# Altium schematic sheet Mother Board FPGA.SchDoc
size A2
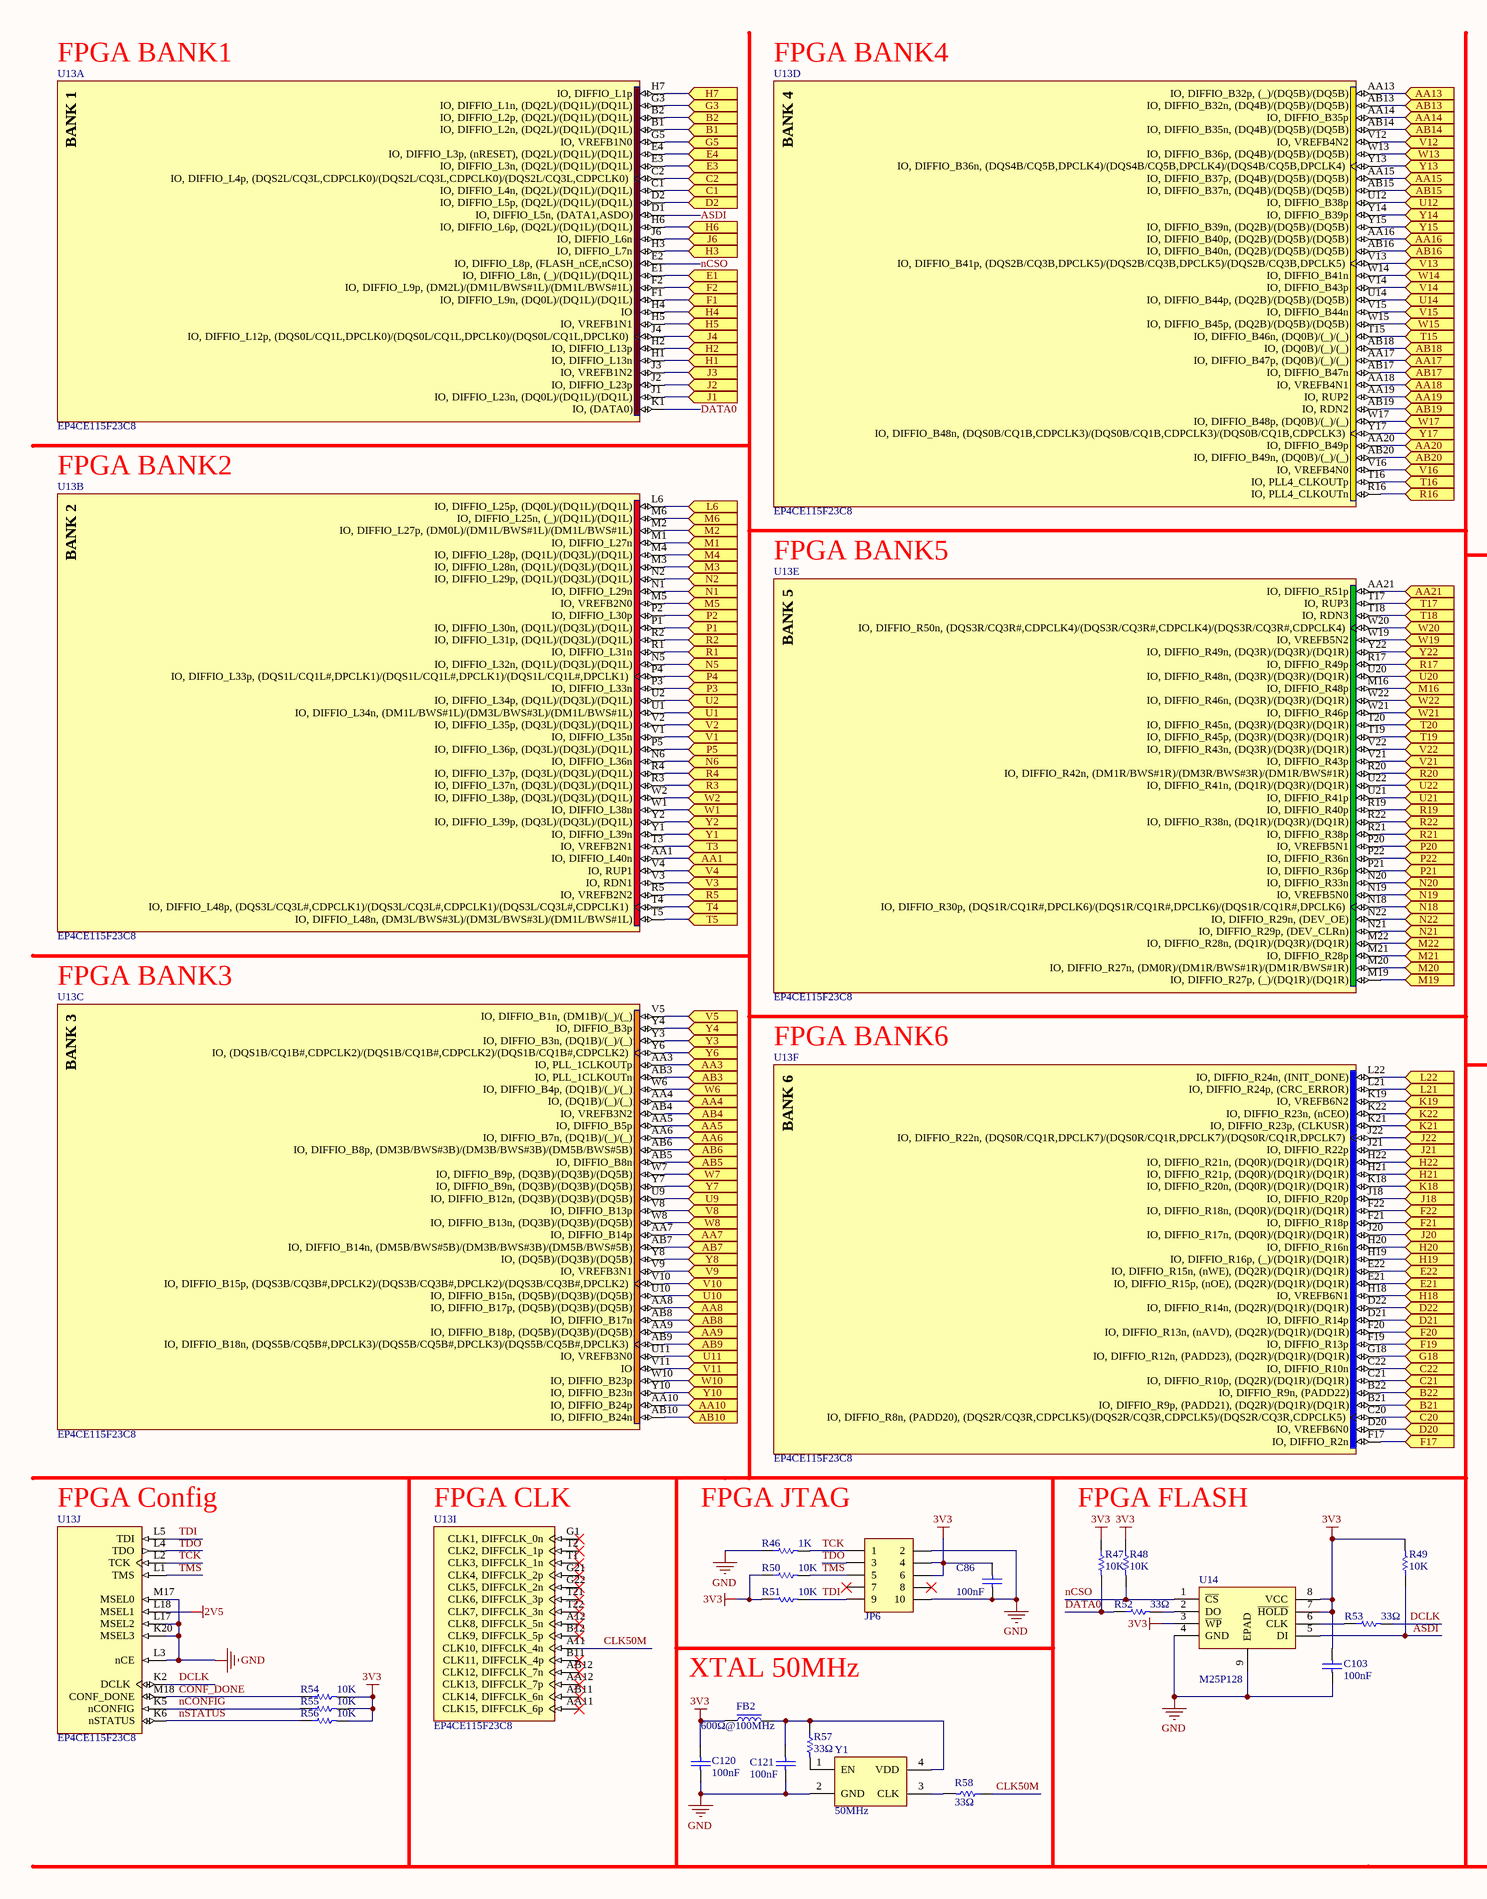
[diagram p0: Mother Board FPGA.SchDoc, left]
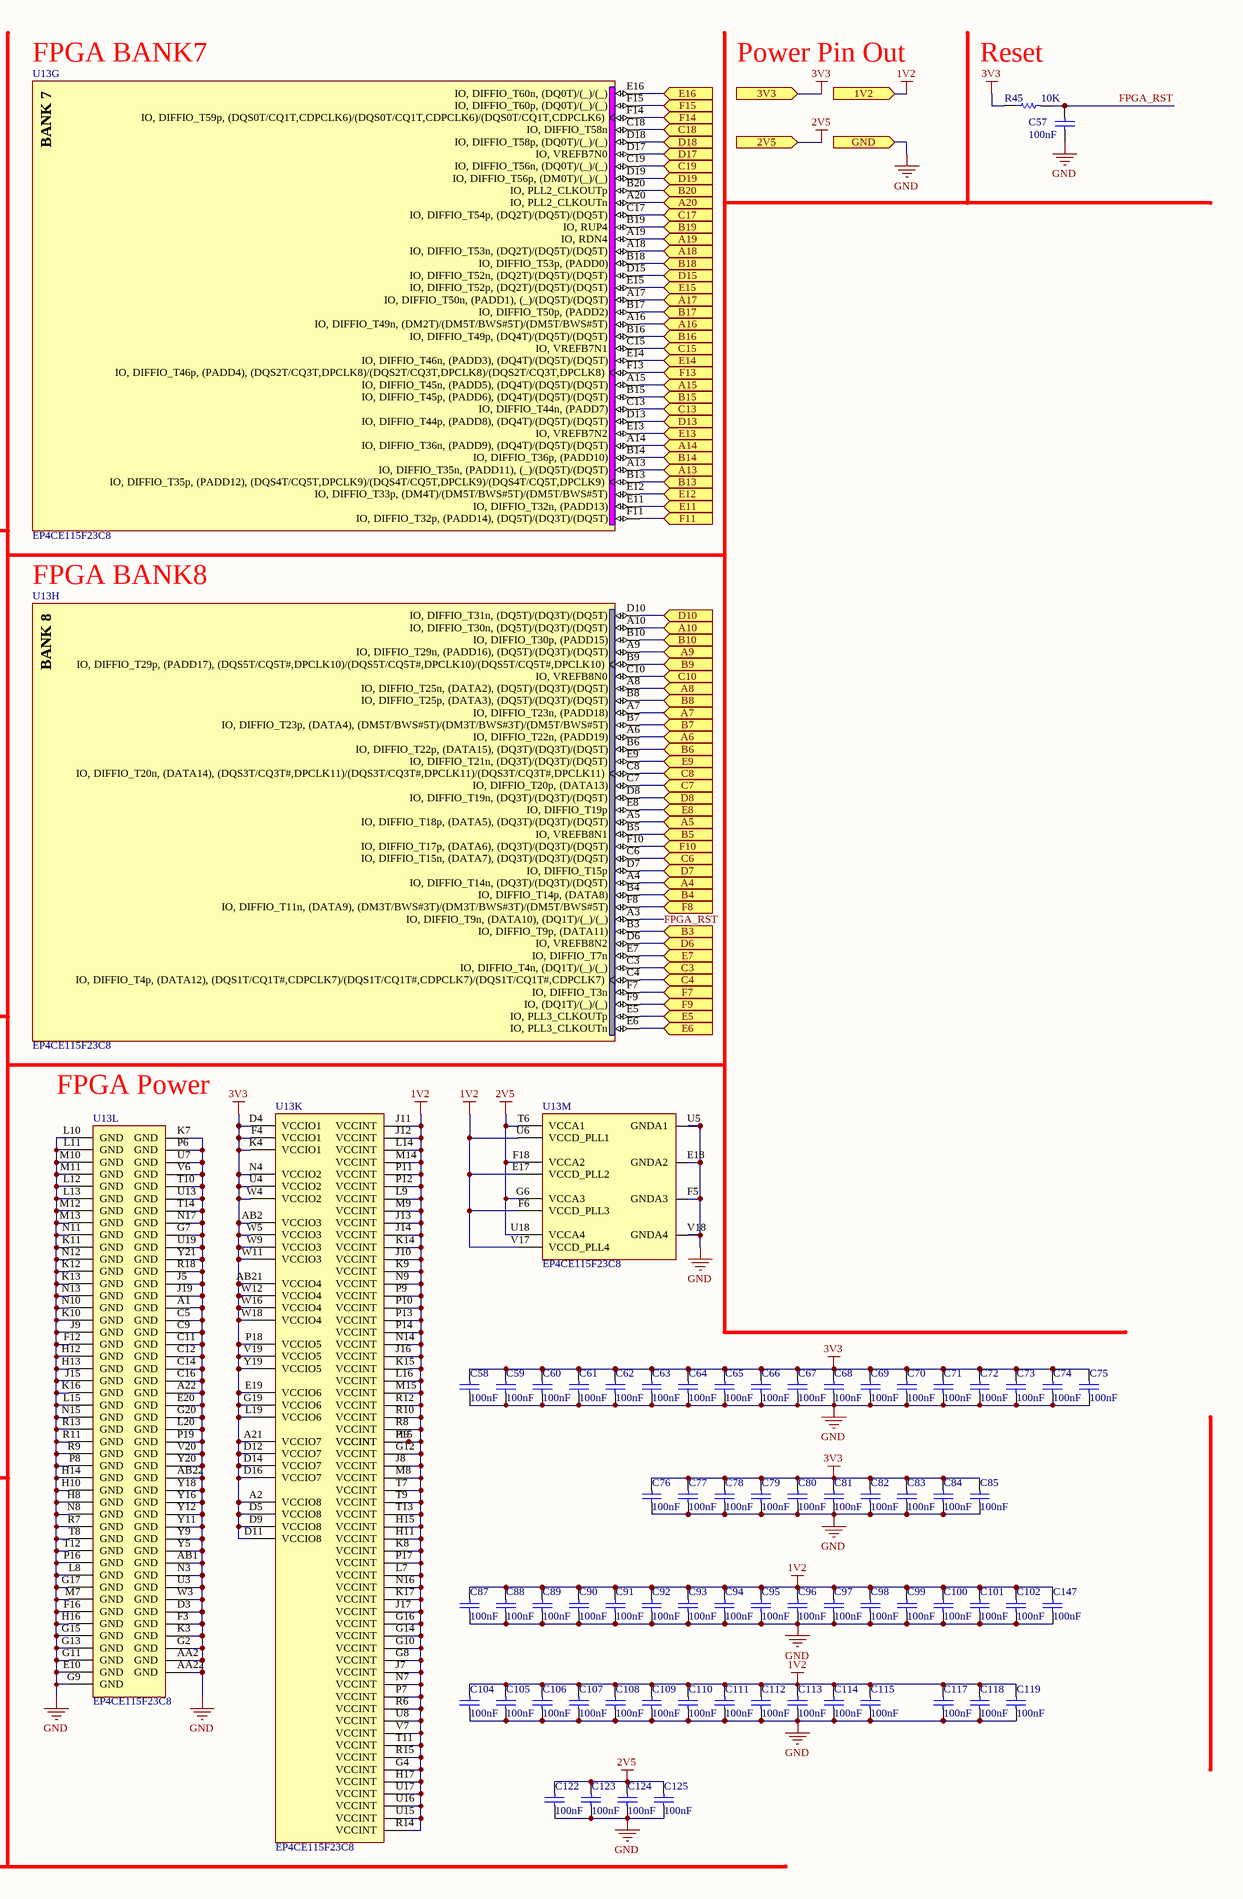
[diagram p1: Mother Board FPGA.SchDoc, right]

## Parts
C57  100nF  [C0402]
C58  100nF  [C0402]
C59  100nF  [C0402]
C60  100nF  [C0402]
C61  100nF  [C0402]
C62  100nF  [C0402]
C63  100nF  [C0402]
C64  100nF  [C0402]
C65  100nF  [C0402]
C66  100nF  [C0402]
C67  100nF  [C0402]
C68  100nF  [C0402]
C69  100nF  [C0402]
C70  100nF  [C0402]
C71  100nF  [C0402]
C72  100nF  [C0402]
C73  100nF  [C0402]
C74  100nF  [C0402]
C75  100nF  [C0402]
C76  100nF  [C0402]
C77  100nF  [C0402]
C78  100nF  [C0402]
C79  100nF  [C0402]
C80  100nF  [C0402]
C81  100nF  [C0402]
C82  100nF  [C0402]
C83  100nF  [C0402]
C84  100nF  [C0402]
C85  100nF  [C0402]
C86  100nF  [C0603]
C87  100nF  [C0402]
C88  100nF  [C0402]
C89  100nF  [C0402]
C90  100nF  [C0402]
C91  100nF  [C0402]
C92  100nF  [C0402]
C93  100nF  [C0402]
C94  100nF  [C0402]
C95  100nF  [C0402]
C96  100nF  [C0402]
C97  100nF  [C0402]
C98  100nF  [C0402]
C99  100nF  [C0402]
C100  100nF  [C0402]
C101  100nF  [C0402]
C102  100nF  [C0402]
C103  100nF  [C0603]
C104  100nF  [C0402]
C105  100nF  [C0402]
C106  100nF  [C0402]
C107  100nF  [C0402]
C108  100nF  [C0402]
C109  100nF  [C0402]
C110  100nF  [C0402]
C111  100nF  [C0402]
C112  100nF  [C0402]
C113  100nF  [C0402]
C114  100nF  [C0402]
C115  100nF  [C0402]
C117  100nF  [C0402]
C118  100nF  [C0402]
C119  100nF  [C0402]
C120  100nF  [C0603]
C121  100nF  [C0603]
C122  100nF  [C0402]
C123  100nF  [C0402]
C124  100nF  [C0402]
C125  100nF  [C0402]
C147  100nF  [C0402]
FB2  600Ω@100MHz  [FB 0603]
JP6  Header 5X2  [DC2.54-10P - L2]  (value not drawn)
R45  10K  [R0402]
R46  1K  [R0603]
R47  10K  [R0603]
R48  10K  [R0603]
R49  10K  [R0603]
R50  10K  [R0603]
R51  10K  [R0603]
R52  33Ω  [R0603]
R53  33Ω  [R0603]
R54  10K  [R0402]
R55  10K  [R0402]
R56  10K  [R0402]
R57  33Ω  [R0603]
R58  33Ω  [R0603]
U13  EP4CE115F23C8  [FBGA484]  (parts A,B,C,D,E,F,G,H,I,J,K,L,M of 13)
U14  M25P128  [WSON8_8X6_MRN]
Y1  50MHz  [XTAL-3225]

## Ports
1V2 (in), 2V5 (in), 3V3 (in), A4 (in), A5 (in), A6 (in), A7 (in), A8 (in), A9 (in), A10 (in), A13 (in), A14 (in), A15 (in), A16 (in), A17 (in), A18 (in), A19 (in), A20 (in), AA1 (in), AA3 (in), AA4 (in), AA5 (in), AA6 (in), AA7 (in), AA8 (in), AA9 (in), AA10 (in), AA13 (in), AA14 (in), AA15 (in), AA16 (in), AA17 (in), AA18 (in), AA19 (in), AA20 (in), AA21 (in), AB3 (in), AB4 (in), AB5 (in), AB6 (in), AB7 (in), AB8 (in), AB9 (in), AB10 (in), AB13 (in), AB14 (in), AB15 (in), AB16 (in), AB17 (in), AB18 (in), AB19 (in), AB20 (in), B1 (in), B2 (in), B3 (in), B4 (in), B5 (in), B6 (in), B7 (in), B8 (in), B9 (in), B10 (in), B13 (in), B14 (in), B15 (in), B16 (in), B17 (in), B18 (in), B19 (in), B20 (in), B21 (in), B22 (in), C1 (in), C2 (in), C3 (in), C4 (in), C6 (in), C7 (in), C8 (in), C10 (in), C13 (in), C15 (in), C17 (in), C18 (in), C19 (in), C20 (in), C21 (in), C22 (in), D2 (in), D6 (in), D7 (in), D8 (in), D10 (in), D13 (in), D15 (in), D17 (in), D18 (in), D19 (in), D20 (in), D21 (in), D22 (in), E1 (in), E3 (in), E4 (in), E5 (in), E6 (in), E7 (in), E8 (in), E9 (in), E11 (in), E12 (in), E13 (in), E14 (in), E15 (in), E16 (in), E21 (in), E22 (in), F1 (in), F2 (in), F7 (in), F8 (in), F9 (in), F10 (in), F11 (in), F13 (in), F14 (in), F15 (in), F17 (in), F19 (in), F20 (in), F21 (in), F22 (in), G3 (in), G5 (in), G18 (in), GND (in), H1 (in), H2 (in), H3 (in), H4 (in), H5 (in), H6 (in), H7 (in), H18 (in), H19 (in), H20 (in), H21 (in), H22 (in), J1 (in), J2 (in), J3 (in), J4 (in), J6 (in), J18 (in), J20 (in), J21 (in), J22 (in), K18 (in), K19 (in), K21 (in), K22 (in), L6 (in), L21 (in), L22 (in), M1 (in), M2 (in), M3 (in), M4 (in), M5 (in), M6 (in), M16 (in), M19 (in), M20 (in), M21 (in), M22 (in), N1 (in), N2 (in), N5 (in), N6 (in), N18 (in), N19 (in), N20 (in), N21 (in), N22 (in), P1 (in), P2 (in), P3 (in), P4 (in), P5 (in), P20 (in), P21 (in), P22 (in), R1 (in), R2 (in), R3 (in), R4 (in), R5 (in), R16 (in), R17 (in), R19 (in), R20 (in), R21 (in), R22 (in), T3 (in), T4 (in), T5 (in), T15 (in), T16 (in), T17 (in), T18 (in), T19 (in), T20 (in), U1 (in), U2 (in), U9 (in), U10 (in), U11 (in), U12 (in), U14 (in), U20 (in), U21 (in), U22 (in), V1 (in), V2 (in), V3 (in), V4 (in), V5 (in), V8 (in), V9 (in), V10 (in), V11 (in), V12 (in), V13 (in), V14 (in), V15 (in), V16 (in), V21 (in), V22 (in), W1 (in), W2 (in), W6 (in), W7 (in), W8 (in), W10 (in), W13 (in), W14 (in), W15 (in), W17 (in), W19 (in), W20 (in), W21 (in), W22 (in), Y1 (in), Y2 (in), Y3 (in), Y4 (in), Y6 (in), Y7 (in), Y8 (in), Y10 (in), Y13 (in), Y14 (in), Y15 (in), Y17 (in), Y22 (in)

## Nets
1V2: C87.2 C88.2 C89.2 C90.2 C91.2 C92.2 C93.2 C94.2 C95.2 C96.2 C97.2 C98.2 C99.2 C100.2 C101.2 C102.2 C104.2 C105.2 C106.2 C107.2 C108.2 C109.2 C110.2 C111.2 C112.2 C113.2 C114.2 C115.2 C117.2 C118.2 C119.2 C147.2 U13.E17(VCCD_PLL2) U13.F6(VCCD_PLL3) U13.G4(VCCINT) U13.G8(VCCINT) U13.G10(VCCINT) U13.G12(VCCINT) U13.G14(VCCINT) U13.G16(VCCINT) U13.H9(VCCINT) U13.H11(VCCINT) U13.H15(VCCINT) U13.H17(VCCINT) U13.J7(VCCINT) U13.J8(VCCINT) U13.J10(VCCINT) U13.J11(VCCINT) U13.J12(VCCINT) U13.J13(VCCINT) U13.J14(VCCINT) U13.J16(VCCINT) U13.J17(VCCINT) U13.K8(VCCINT) U13.K9(VCCINT) U13.K14(VCCINT) U13.K15(VCCINT) U13.K17(VCCINT) U13.L7(VCCINT) U13.L9(VCCINT) U13.L14(VCCINT) U13.L16(VCCINT) U13.M8(VCCINT) U13.M9(VCCINT) U13.M14(VCCINT) U13.M15(VCCINT) U13.N7(VCCINT) U13.N9(VCCINT) U13.N14(VCCINT) U13.N16(VCCINT) U13.P7(VCCINT) U13.P9(VCCINT) U13.P10(VCCINT) U13.P11(VCCINT) U13.P12(VCCINT) U13.P13(VCCINT) U13.P14(VCCINT) U13.P15(VCCINT) U13.P17(VCCINT) U13.R6(VCCINT) U13.R8(VCCINT) U13.R10(VCCINT) U13.R12(VCCINT) U13.R14(VCCINT) U13.R15(VCCINT) U13.T7(VCCINT) U13.T9(VCCINT) U13.T11(VCCINT) U13.T13(VCCINT) U13.U6(VCCD_PLL1) U13.U8(VCCINT) U13.U15(VCCINT) U13.U16(VCCINT) U13.U17(VCCINT) U13.V7(VCCINT) U13.V17(VCCD_PLL4) ; port 1V2
2V5: C122.2 C123.2 C124.2 C125.2 U13.F18(VCCA2) U13.G6(VCCA3) U13.L18(MSEL1) U13.T6(VCCA1) U13.U18(VCCA4) ; port 2V5
3V3: C58.2 C59.2 C60.2 C61.2 C62.2 C63.2 C64.2 C65.2 C66.2 C67.2 C68.2 C69.2 C70.2 C71.2 C72.2 C73.2 C74.2 C75.2 C76.2 C77.2 C78.2 C79.2 C80.2 C81.2 C82.2 C83.2 C84.2 C85.2 C86.2 C103.1 C120.1 FB2.1 JP6.4 JP6.6 R45.1 R47.1 R48.1 R49.2 R50.1 R51.1 R54.2 R55.2 R56.2 U13.A2(VCCIO8) U13.A21(VCCIO7) U13.AB2(VCCIO3) U13.AB21(VCCIO4) U13.D4(VCCIO1) U13.D5(VCCIO8) U13.D9(VCCIO8) U13.D11(VCCIO8) U13.D12(VCCIO7) U13.D14(VCCIO7) U13.D16(VCCIO7) U13.E19(VCCIO6) U13.F4(VCCIO1) U13.G19(VCCIO6) U13.K4(VCCIO1) U13.L19(VCCIO6) U13.N4(VCCIO2) U13.P18(VCCIO5) U13.U4(VCCIO2) U13.V19(VCCIO5) U13.W4(VCCIO2) U13.W5(VCCIO3) U13.W9(VCCIO3) U13.W11(VCCIO3) U13.W12(VCCIO4) U13.W16(VCCIO4) U13.W18(VCCIO4) U13.Y19(VCCIO5) U14.3(~{WP}) U14.7(~{HOLD}) U14.8(VCC) ; port 3V3
GND: C57.1 C58.1 C59.1 C60.1 C61.1 C62.1 C63.1 C64.1 C65.1 C66.1 C67.1 C68.1 C69.1 C70.1 C71.1 C72.1 C73.1 C74.1 C75.1 C76.1 C77.1 C78.1 C79.1 C80.1 C81.1 C82.1 C83.1 C84.1 C85.1 C86.1 C87.1 C88.1 C89.1 C90.1 C91.1 C92.1 C93.1 C94.1 C95.1 C96.1 C97.1 C98.1 C99.1 C100.1 C101.1 C102.1 C103.2 C104.1 C105.1 C106.1 C107.1 C108.1 C109.1 C110.1 C111.1 C112.1 C113.1 C114.1 C115.1 C117.1 C118.1 C119.1 C120.2 C121.1 C122.1 C123.1 C124.1 C125.1 C147.1 JP6.2 JP6.10 R46.1 U13.A1(GND) U13.A22(GND) U13.AA2(GND) U13.AA22(GND) U13.AB1(GND) U13.AB22(GND) U13.C5(GND) U13.C9(GND) U13.C11(GND) U13.C12(GND) U13.C14(GND) U13.C16(GND) U13.D3(GND) U13.E10(GND) U13.E18(GNDA2) U13.E20(GND) U13.F3(GND) U13.F5(GNDA3) U13.F12(GND) U13.F16(GND) U13.G2(GND) U13.G7(GND) U13.G9(GND) U13.G11(GND) U13.G13(GND) U13.G15(GND) U13.G17(GND) U13.G20(GND) U13.H8(GND) U13.H10(GND) U13.H12(GND) U13.H13(GND) U13.H14(GND) U13.H16(GND) U13.J5(GND) U13.J9(GND) U13.J15(GND) U13.J19(GND) U13.K3(GND) U13.K7(GND) U13.K10(GND) U13.K11(GND) U13.K12(GND) U13.K13(GND) U13.K16(GND) U13.K20(MSEL3) U13.L3(nCE) U13.L8(GND) U13.L10(GND) U13.L11(GND) U13.L12(GND) U13.L13(GND) U13.L15(GND) U13.L17(MSEL2) U13.L20(GND) U13.M7(GND) U13.M10(GND) U13.M11(GND) U13.M12(GND) U13.M13(GND) U13.M17(MSEL0) U13.N3(GND) U13.N8(GND) U13.N10(GND) U13.N11(GND) U13.N12(GND) U13.N13(GND) U13.N15(GND) U13.N17(GND) U13.P6(GND) U13.P8(GND) U13.P16(GND) U13.P19(GND) U13.R7(GND) U13.R9(GND) U13.R11(GND) U13.R13(GND) U13.R18(GND) U13.T8(GND) U13.T10(GND) U13.T12(GND) U13.T14(GND) U13.U3(GND) U13.U5(GNDA1) U13.U7(GND) U13.U13(GND) U13.U19(GND) U13.V6(GND) U13.V18(GNDA4) U13.V20(GND) U13.W3(GND) U13.Y5(GND) U13.Y9(GND) U13.Y11(GND) U13.Y12(GND) U13.Y16(GND) U13.Y18(GND) U13.Y20(GND) U13.Y21(GND) U14.4(GND) U14.9(EPAD) Y1.2(GND) ; port GND
A4: U13.A4(IO,_DIFFIO_T14n,_(DQ3T)/(DQ3T)/(DQ5T)) ; port A4
A5: U13.A5(IO,_DIFFIO_T18p,_(DATA5),_(DQ3T)/(DQ3T)/(DQ5T)) ; port A5
A6: U13.A6(IO,_DIFFIO_T22n,_(PADD19)) ; port A6
A7: U13.A7(IO,_DIFFIO_T23n,_(PADD18)) ; port A7
A8: U13.A8(IO,_DIFFIO_T25n,_(DATA2),_(DQ5T)/(DQ3T)/(DQ5T)) ; port A8
A9: U13.A9(IO,_DIFFIO_T29n,_(PADD16),_(DQ5T)/(DQ3T)/(DQ5T)) ; port A9
A10: U13.A10(IO,_DIFFIO_T30n,_(DQ5T)/(DQ3T)/(DQ5T)) ; port A10
A13: U13.A13(IO,_DIFFIO_T35n,_(PADD11),_(_)/(DQ5T)/(DQ5T)) ; port A13
A14: U13.A14(IO,_DIFFIO_T36n,_(PADD9),_(DQ4T)/(DQ5T)/(DQ5T)) ; port A14
A15: U13.A15(IO,_DIFFIO_T45n,_(PADD5),_(DQ4T)/(DQ5T)/(DQ5T)) ; port A15
A16: U13.A16(IO,_DIFFIO_T49n,_(DM2T)/(DM5T/BWS#5T)/(DM5T/BWS#5T)) ; port A16
A17: U13.A17(IO,_DIFFIO_T50n,_(PADD1),_(_)/(DQ5T)/(DQ5T)) ; port A17
A18: U13.A18(IO,_DIFFIO_T53n,_(DQ2T)/(DQ5T)/(DQ5T)) ; port A18
A19: U13.A19(IO,_RDN4) ; port A19
A20: U13.A20(IO,_PLL2_CLKOUTn) ; port A20
AA1: U13.AA1(IO,_DIFFIO_L40n) ; port AA1
AA3: U13.AA3(IO,_PLL_1CLKOUTp) ; port AA3
AA4: U13.AA4(IO,_(DQ1B)/(_)/(_)) ; port AA4
AA5: U13.AA5(IO,_DIFFIO_B5p) ; port AA5
AA6: U13.AA6(IO,_DIFFIO_B7n,_(DQ1B)/(_)/(_)) ; port AA6
AA7: U13.AA7(IO,_DIFFIO_B14p) ; port AA7
AA8: U13.AA8(IO,_DIFFIO_B17p,_(DQ5B)/(DQ3B)/(DQ5B)) ; port AA8
AA9: U13.AA9(IO,_DIFFIO_B18p,_(DQ5B)/(DQ3B)/(DQ5B)) ; port AA9
AA10: U13.AA10(IO,_DIFFIO_B24p) ; port AA10
AA13: U13.AA13(IO,_DIFFIO_B32p,_(_)/(DQ5B)/(DQ5B)) ; port AA13
AA14: U13.AA14(IO,_DIFFIO_B35p) ; port AA14
AA15: U13.AA15(IO,_DIFFIO_B37p,_(DQ4B)/(DQ5B)/(DQ5B)) ; port AA15
AA16: U13.AA16(IO,_DIFFIO_B40p,_(DQ2B)/(DQ5B)/(DQ5B)) ; port AA16
AA17: U13.AA17(IO,_DIFFIO_B47p,_(DQ0B)/(_)/(_)) ; port AA17
AA18: U13.AA18(IO,_VREFB4N1) ; port AA18
AA19: U13.AA19(IO,_RUP2) ; port AA19
AA20: U13.AA20(IO,_DIFFIO_B49p) ; port AA20
AA21: U13.AA21(IO,_DIFFIO_R51p) ; port AA21
AB3: U13.AB3(IO,_PLL_1CLKOUTn) ; port AB3
AB4: U13.AB4(IO,_VREFB3N2) ; port AB4
AB5: U13.AB5(IO,_DIFFIO_B8n) ; port AB5
AB6: U13.AB6(IO,_DIFFIO_B8p,_(DM3B/BWS#3B)/(DM3B/BWS#3B)/(DM5B/BWS#5B)) ; port AB6
AB7: U13.AB7(IO,_DIFFIO_B14n,_(DM5B/BWS#5B)/(DM3B/BWS#3B)/(DM5B/BWS#5B)) ; port AB7
AB8: U13.AB8(IO,_DIFFIO_B17n) ; port AB8
AB9: U13.AB9(IO,_DIFFIO_B18n,_(DQS5B/CQ5B#,DPCLK3)/(DQS5B/CQ5B#,DPCLK3)/(DQS5B/CQ5B#,DPCLK3)) ; port AB9
AB10: U13.AB10(IO,_DIFFIO_B24n) ; port AB10
AB13: U13.AB13(IO,_DIFFIO_B32n,_(DQ4B)/(DQ5B)/(DQ5B)) ; port AB13
AB14: U13.AB14(IO,_DIFFIO_B35n,_(DQ4B)/(DQ5B)/(DQ5B)) ; port AB14
AB15: U13.AB15(IO,_DIFFIO_B37n,_(DQ4B)/(DQ5B)/(DQ5B)) ; port AB15
AB16: U13.AB16(IO,_DIFFIO_B40n,_(DQ2B)/(DQ5B)/(DQ5B)) ; port AB16
AB17: U13.AB17(IO,_DIFFIO_B47n) ; port AB17
AB18: U13.AB18(IO,_(DQ0B)/(_)/(_)) ; port AB18
AB19: U13.AB19(IO,_RDN2) ; port AB19
AB20: U13.AB20(IO,_DIFFIO_B49n,_(DQ0B)/(_)/(_)) ; port AB20
ASDI: R49.1 U13.D1(IO,_DIFFIO_L5n,_(DATA1,ASDO)) U14.5(DI)
B1: U13.B1(IO,_DIFFIO_L2n,_(DQ2L)/(DQ1L)/(DQ1L)) ; port B1
B2: U13.B2(IO,_DIFFIO_L2p,_(DQ2L)/(DQ1L)/(DQ1L)) ; port B2
B3: U13.B3(IO,_DIFFIO_T9p,_(DATA11)) ; port B3
B4: U13.B4(IO,_DIFFIO_T14p,_(DATA8)) ; port B4
B5: U13.B5(IO,_VREFB8N1) ; port B5
B6: U13.B6(IO,_DIFFIO_T22p,_(DATA15),_(DQ3T)/(DQ3T)/(DQ5T)) ; port B6
B7: U13.B7(IO,_DIFFIO_T23p,_(DATA4),_(DM5T/BWS#5T)/(DM3T/BWS#3T)/(DM5T/BWS#5T)) ; port B7
B8: U13.B8(IO,_DIFFIO_T25p,_(DATA3),_(DQ5T)/(DQ3T)/(DQ5T)) ; port B8
B9: U13.B9(IO,_DIFFIO_T29p,_(PADD17),_(DQS5T/CQ5T#,DPCLK10)/(DQS5T/CQ5T#,DPCLK10)/(DQS5T/CQ5T#,DPCLK10)) ; port B9
B10: U13.B10(IO,_DIFFIO_T30p,_(PADD15)) ; port B10
B13: U13.B13(IO,_DIFFIO_T35p,_(PADD12),_(DQS4T/CQ5T,DPCLK9)/(DQS4T/CQ5T,DPCLK9)/(DQS4T/CQ5T,DPCLK9)) ; port B13
B14: U13.B14(IO,_DIFFIO_T36p,_(PADD10)) ; port B14
B15: U13.B15(IO,_DIFFIO_T45p,_(PADD6),_(DQ4T)/(DQ5T)/(DQ5T)) ; port B15
B16: U13.B16(IO,_DIFFIO_T49p,_(DQ4T)/(DQ5T)/(DQ5T)) ; port B16
B17: U13.B17(IO,_DIFFIO_T50p,_(PADD2)) ; port B17
B18: U13.B18(IO,_DIFFIO_T53p,_(PADD0)) ; port B18
B19: U13.B19(IO,_RUP4) ; port B19
B20: U13.B20(IO,_PLL2_CLKOUTp) ; port B20
B21: U13.B21(IO,_DIFFIO_R9p,_(PADD21),_(DQ2R)/(DQ1R)/(DQ1R)) ; port B21
B22: U13.B22(IO,_DIFFIO_R9n,_(PADD22)) ; port B22
C1: U13.C1(IO,_DIFFIO_L4n,_(DQ2L)/(DQ1L)/(DQ1L)) ; port C1
C2: U13.C2(IO,_DIFFIO_L4p,_(DQS2L/CQ3L,CDPCLK0)/(DQS2L/CQ3L,CDPCLK0)/(DQS2L/CQ3L,CDPCLK0)) ; port C2
C3: U13.C3(IO,_DIFFIO_T4n,_(DQ1T)/(_)/(_)) ; port C3
C4: U13.C4(IO,_DIFFIO_T4p,_(DATA12),_(DQS1T/CQ1T#,CDPCLK7)/(DQS1T/CQ1T#,CDPCLK7)/(DQS1T/CQ1T#,CDPCLK7)) ; port C4
C6: U13.C6(IO,_DIFFIO_T15n,_(DATA7),_(DQ3T)/(DQ3T)/(DQ5T)) ; port C6
C7: U13.C7(IO,_DIFFIO_T20p,_(DATA13)) ; port C7
C8: U13.C8(IO,_DIFFIO_T20n,_(DATA14),_(DQS3T/CQ3T#,DPCLK11)/(DQS3T/CQ3T#,DPCLK11)/(DQS3T/CQ3T#,DPCLK11)) ; port C8
C10: U13.C10(IO,_VREFB8N0) ; port C10
C13: U13.C13(IO,_DIFFIO_T44n,_(PADD7)) ; port C13
C15: U13.C15(IO,_VREFB7N1) ; port C15
C17: U13.C17(IO,_DIFFIO_T54p,_(DQ2T)/(DQ5T)/(DQ5T)) ; port C17
C18: U13.C18(IO,_DIFFIO_T58n) ; port C18
C19: U13.C19(IO,_DIFFIO_T56n,_(DQ0T)/(_)/(_)) ; port C19
C20: U13.C20(IO,_DIFFIO_R8n,_(PADD20),_(DQS2R/CQ3R,CDPCLK5)/(DQS2R/CQ3R,CDPCLK5)/(DQS2R/CQ3R,CDPCLK5)) ; port C20
C21: U13.C21(IO,_DIFFIO_R10p,_(DQ2R)/(DQ1R)/(DQ1R)) ; port C21
C22: U13.C22(IO,_DIFFIO_R10n) ; port C22
CLK50M: R58.1 U13.A11(CLK10,_DIFFCLK_4n)
CONF_DONE: R54.1 U13.M18(CONF_DONE)
D2: U13.D2(IO,_DIFFIO_L5p,_(DQ2L)/(DQ1L)/(DQ1L)) ; port D2
D6: U13.D6(IO,_VREFB8N2) ; port D6
D7: U13.D7(IO,_DIFFIO_T15p) ; port D7
D8: U13.D8(IO,_DIFFIO_T19n,_(DQ3T)/(DQ3T)/(DQ5T)) ; port D8
D10: U13.D10(IO,_DIFFIO_T31n,_(DQ5T)/(DQ3T)/(DQ5T)) ; port D10
D13: U13.D13(IO,_DIFFIO_T44p,_(PADD8),_(DQ4T)/(DQ5T)/(DQ5T)) ; port D13
D15: U13.D15(IO,_DIFFIO_T52n,_(DQ2T)/(DQ5T)/(DQ5T)) ; port D15
D17: U13.D17(IO,_VREFB7N0) ; port D17
D18: U13.D18(IO,_DIFFIO_T58p,_(DQ0T)/(_)/(_)) ; port D18
D19: U13.D19(IO,_DIFFIO_T56p,_(DM0T)/(_)/(_)) ; port D19
D20: U13.D20(IO,_VREFB6N0) ; port D20
D21: U13.D21(IO,_DIFFIO_R14p) ; port D21
D22: U13.D22(IO,_DIFFIO_R14n,_(DQ2R)/(DQ1R)/(DQ1R)) ; port D22
DATA0: R47.2 R52.1 U13.K1(IO,_(DATA0))
DCLK: R53.2 U13.K2(DCLK)
E1: U13.E1(IO,_DIFFIO_L8n,_(_)/(DQ1L)/(DQ1L)) ; port E1
E3: U13.E3(IO,_DIFFIO_L3n,_(DQ2L)/(DQ1L)/(DQ1L)) ; port E3
E4: U13.E4(IO,_DIFFIO_L3p,_(nRESET),_(DQ2L)/(DQ1L)/(DQ1L)) ; port E4
E5: U13.E5(IO,_PLL3_CLKOUTp) ; port E5
E6: U13.E6(IO,_PLL3_CLKOUTn) ; port E6
E7: U13.E7(IO,_DIFFIO_T7n) ; port E7
E8: U13.E8(IO,_DIFFIO_T19p) ; port E8
E9: U13.E9(IO,_DIFFIO_T21n,_(DQ3T)/(DQ3T)/(DQ5T)) ; port E9
E11: U13.E11(IO,_DIFFIO_T32n,_(PADD13)) ; port E11
E12: U13.E12(IO,_DIFFIO_T33p,_(DM4T)/(DM5T/BWS#5T)/(DM5T/BWS#5T)) ; port E12
E13: U13.E13(IO,_VREFB7N2) ; port E13
E14: U13.E14(IO,_DIFFIO_T46n,_(PADD3),_(DQ4T)/(DQ5T)/(DQ5T)) ; port E14
E15: U13.E15(IO,_DIFFIO_T52p,_(DQ2T)/(DQ5T)/(DQ5T)) ; port E15
E16: U13.E16(IO,_DIFFIO_T60n,_(DQ0T)/(_)/(_)) ; port E16
E21: U13.E21(IO,_DIFFIO_R15p,_(nOE),_(DQ2R)/(DQ1R)/(DQ1R)) ; port E21
E22: U13.E22(IO,_DIFFIO_R15n,_(nWE),_(DQ2R)/(DQ1R)/(DQ1R)) ; port E22
F1: U13.F1(IO,_DIFFIO_L9n,_(DQ0L)/(DQ1L)/(DQ1L)) ; port F1
F2: U13.F2(IO,_DIFFIO_L9p,_(DM2L)/(DM1L/BWS#1L)/(DM1L/BWS#1L)) ; port F2
F7: U13.F7(IO,_DIFFIO_T3n) ; port F7
F8: U13.F8(IO,_DIFFIO_T11n,_(DATA9),_(DM3T/BWS#3T)/(DM3T/BWS#3T)/(DM5T/BWS#5T)) ; port F8
F9: U13.F9(IO,_(DQ1T)/(_)/(_)) ; port F9
F10: U13.F10(IO,_DIFFIO_T17p,_(DATA6),_(DQ3T)/(DQ3T)/(DQ5T)) ; port F10
F11: U13.F11(IO,_DIFFIO_T32p,_(PADD14),_(DQ5T)/(DQ3T)/(DQ5T)) ; port F11
F13: U13.F13(IO,_DIFFIO_T46p,_(PADD4),_(DQS2T/CQ3T,DPCLK8)/(DQS2T/CQ3T,DPCLK8)/(DQS2T/CQ3T,DPCLK8)) ; port F13
F14: U13.F14(IO,_DIFFIO_T59p,_(DQS0T/CQ1T,CDPCLK6)/(DQS0T/CQ1T,CDPCLK6)/(DQS0T/CQ1T,CDPCLK6)) ; port F14
F15: U13.F15(IO,_DIFFIO_T60p,_(DQ0T)/(_)/(_)) ; port F15
F17: U13.F17(IO,_DIFFIO_R2n) ; port F17
F19: U13.F19(IO,_DIFFIO_R13p) ; port F19
F20: U13.F20(IO,_DIFFIO_R13n,_(nAVD),_(DQ2R)/(DQ1R)/(DQ1R)) ; port F20
F21: U13.F21(IO,_DIFFIO_R18p) ; port F21
F22: U13.F22(IO,_DIFFIO_R18n,_(DQ0R)/(DQ1R)/(DQ1R)) ; port F22
FPGA_RST: C57.2 R45.2 U13.A3(IO,_DIFFIO_T9n,_(DATA10),_(DQ1T)/(_)/(_))
G3: U13.G3(IO,_DIFFIO_L1n,_(DQ2L)/(DQ1L)/(DQ1L)) ; port G3
G5: U13.G5(IO,_VREFB1N0) ; port G5
G18: U13.G18(IO,_DIFFIO_R12n,_(PADD23),_(DQ2R)/(DQ1R)/(DQ1R)) ; port G18
H1: U13.H1(IO,_DIFFIO_L13n) ; port H1
H2: U13.H2(IO,_DIFFIO_L13p) ; port H2
H3: U13.H3(IO,_DIFFIO_L7n) ; port H3
H4: U13.H4(IO) ; port H4
H5: U13.H5(IO,_VREFB1N1) ; port H5
H6: U13.H6(IO,_DIFFIO_L6p,_(DQ2L)/(DQ1L)/(DQ1L)) ; port H6
H7: U13.H7(IO,_DIFFIO_L1p) ; port H7
H18: U13.H18(IO,_VREFB6N1) ; port H18
H19: U13.H19(IO,_DIFFIO_R16p,_(_)/(DQ1R)/(DQ1R)) ; port H19
H20: U13.H20(IO,_DIFFIO_R16n) ; port H20
H21: U13.H21(IO,_DIFFIO_R21p,_(DQ0R)/(DQ1R)/(DQ1R)) ; port H21
H22: U13.H22(IO,_DIFFIO_R21n,_(DQ0R)/(DQ1R)/(DQ1R)) ; port H22
J1: U13.J1(IO,_DIFFIO_L23n,_(DQ0L)/(DQ1L)/(DQ1L)) ; port J1
J2: U13.J2(IO,_DIFFIO_L23p) ; port J2
J3: U13.J3(IO,_VREFB1N2) ; port J3
J4: U13.J4(IO,_DIFFIO_L12p,_(DQS0L/CQ1L,DPCLK0)/(DQS0L/CQ1L,DPCLK0)/(DQS0L/CQ1L,DPCLK0)) ; port J4
J6: U13.J6(IO,_DIFFIO_L6n) ; port J6
J18: U13.J18(IO,_DIFFIO_R20p) ; port J18
J20: U13.J20(IO,_DIFFIO_R17n,_(DQ0R)/(DQ1R)/(DQ1R)) ; port J20
J21: U13.J21(IO,_DIFFIO_R22p) ; port J21
J22: U13.J22(IO,_DIFFIO_R22n,_(DQS0R/CQ1R,DPCLK7)/(DQS0R/CQ1R,DPCLK7)/(DQS0R/CQ1R,DPCLK7)) ; port J22
K18: U13.K18(IO,_DIFFIO_R20n,_(DQ0R)/(DQ1R)/(DQ1R)) ; port K18
K19: U13.K19(IO,_VREFB6N2) ; port K19
K21: U13.K21(IO,_DIFFIO_R23p,_(CLKUSR)) ; port K21
K22: U13.K22(IO,_DIFFIO_R23n,_(nCEO)) ; port K22
L6: U13.L6(IO,_DIFFIO_L25p,_(DQ0L)/(DQ1L)/(DQ1L)) ; port L6
L21: U13.L21(IO,_DIFFIO_R24p,_(CRC_ERROR)) ; port L21
L22: U13.L22(IO,_DIFFIO_R24n,_(INIT_DONE)) ; port L22
M1: U13.M1(IO,_DIFFIO_L27n) ; port M1
M2: U13.M2(IO,_DIFFIO_L27p,_(DM0L)/(DM1L/BWS#1L)/(DM1L/BWS#1L)) ; port M2
M3: U13.M3(IO,_DIFFIO_L28n,_(DQ1L)/(DQ3L)/(DQ1L)) ; port M3
M4: U13.M4(IO,_DIFFIO_L28p,_(DQ1L)/(DQ3L)/(DQ1L)) ; port M4
M5: U13.M5(IO,_VREFB2N0) ; port M5
M6: U13.M6(IO,_DIFFIO_L25n,_(_)/(DQ1L)/(DQ1L)) ; port M6
M16: U13.M16(IO,_DIFFIO_R48p) ; port M16
M19: U13.M19(IO,_DIFFIO_R27p,_(_)/(DQ1R)/(DQ1R)) ; port M19
M20: U13.M20(IO,_DIFFIO_R27n,_(DM0R)/(DM1R/BWS#1R)/(DM1R/BWS#1R)) ; port M20
M21: U13.M21(IO,_DIFFIO_R28p) ; port M21
M22: U13.M22(IO,_DIFFIO_R28n,_(DQ1R)/(DQ3R)/(DQ1R)) ; port M22
N1: U13.N1(IO,_DIFFIO_L29n) ; port N1
N2: U13.N2(IO,_DIFFIO_L29p,_(DQ1L)/(DQ3L)/(DQ1L)) ; port N2
N5: U13.N5(IO,_DIFFIO_L32n,_(DQ1L)/(DQ3L)/(DQ1L)) ; port N5
N6: U13.N6(IO,_DIFFIO_L36n) ; port N6
N18: U13.N18(IO,_DIFFIO_R30p,_(DQS1R/CQ1R#,DPCLK6)/(DQS1R/CQ1R#,DPCLK6)/(DQS1R/CQ1R#,DPCLK6)) ; port N18
N19: U13.N19(IO,_VREFB5N0) ; port N19
N20: U13.N20(IO,_DIFFIO_R33n) ; port N20
N21: U13.N21(IO,_DIFFIO_R29p,_(DEV_CLRn)) ; port N21
N22: U13.N22(IO,_DIFFIO_R29n,_(DEV_OE)) ; port N22
nCONFIG: R55.1 U13.K5(nCONFIG)
nCSO: R48.2 U13.E2(IO,_DIFFIO_L8p,_(FLASH_nCE,nCSO)) U14.1(~{CS})
nSTATUS: R56.1 U13.K6(nSTATUS)
P1: U13.P1(IO,_DIFFIO_L30n,_(DQ1L)/(DQ3L)/(DQ1L)) ; port P1
P2: U13.P2(IO,_DIFFIO_L30p) ; port P2
P3: U13.P3(IO,_DIFFIO_L33n) ; port P3
P4: U13.P4(IO,_DIFFIO_L33p,_(DQS1L/CQ1L#,DPCLK1)/(DQS1L/CQ1L#,DPCLK1)/(DQS1L/CQ1L#,DPCLK1)) ; port P4
P5: U13.P5(IO,_DIFFIO_L36p,_(DQ3L)/(DQ3L)/(DQ1L)) ; port P5
P20: U13.P20(IO,_VREFB5N1) ; port P20
P21: U13.P21(IO,_DIFFIO_R36p) ; port P21
P22: U13.P22(IO,_DIFFIO_R36n) ; port P22
R1: U13.R1(IO,_DIFFIO_L31n) ; port R1
R2: U13.R2(IO,_DIFFIO_L31p,_(DQ1L)/(DQ3L)/(DQ1L)) ; port R2
R3: U13.R3(IO,_DIFFIO_L37n,_(DQ3L)/(DQ3L)/(DQ1L)) ; port R3
R4: U13.R4(IO,_DIFFIO_L37p,_(DQ3L)/(DQ3L)/(DQ1L)) ; port R4
R5: U13.R5(IO,_VREFB2N2) ; port R5
R16: U13.R16(IO,_PLL4_CLKOUTn) ; port R16
R17: U13.R17(IO,_DIFFIO_R49p) ; port R17
R19: U13.R19(IO,_DIFFIO_R40p) ; port R19
R20: U13.R20(IO,_DIFFIO_R42n,_(DM1R/BWS#1R)/(DM3R/BWS#3R)/(DM1R/BWS#1R)) ; port R20
R21: U13.R21(IO,_DIFFIO_R38p) ; port R21
R22: U13.R22(IO,_DIFFIO_R38n,_(DQ1R)/(DQ3R)/(DQ1R)) ; port R22
T3: U13.T3(IO,_VREFB2N1) ; port T3
T4: U13.T4(IO,_DIFFIO_L48p,_(DQS3L/CQ3L#,CDPCLK1)/(DQS3L/CQ3L#,CDPCLK1)/(DQS3L/CQ3L#,CDPCLK1)) ; port T4
T5: U13.T5(IO,_DIFFIO_L48n,_(DM3L/BWS#3L)/(DM3L/BWS#3L)/(DM1L/BWS#1L)) ; port T5
T15: U13.T15(IO,_DIFFIO_B46n,_(DQ0B)/(_)/(_)) ; port T15
T16: U13.T16(IO,_PLL4_CLKOUTp) ; port T16
T17: U13.T17(IO,_RUP3) ; port T17
T18: U13.T18(IO,_RDN3) ; port T18
T19: U13.T19(IO,_DIFFIO_R45p,_(DQ3R)/(DQ3R)/(DQ1R)) ; port T19
T20: U13.T20(IO,_DIFFIO_R45n,_(DQ3R)/(DQ3R)/(DQ1R)) ; port T20
TCK: JP6.1 R46.2 U13.L2(TCK)
TDI: JP6.9 R51.2 U13.L5(TDI)
TDO: JP6.3 U13.L4(TDO)
TMS: JP6.5 R50.2 U13.L1(TMS)
U1: U13.U1(IO,_DIFFIO_L34n,_(DM1L/BWS#1L)/(DM3L/BWS#3L)/(DM1L/BWS#1L)) ; port U1
U2: U13.U2(IO,_DIFFIO_L34p,_(DQ1L)/(DQ3L)/(DQ1L)) ; port U2
U9: U13.U9(IO,_DIFFIO_B12n,_(DQ3B)/(DQ3B)/(DQ5B)) ; port U9
U10: U13.U10(IO,_DIFFIO_B15n,_(DQ5B)/(DQ3B)/(DQ5B)) ; port U10
U11: U13.U11(IO,_VREFB3N0) ; port U11
U12: U13.U12(IO,_DIFFIO_B38p) ; port U12
U14: U13.U14(IO,_DIFFIO_B44p,_(DQ2B)/(DQ5B)/(DQ5B)) ; port U14
U20: U13.U20(IO,_DIFFIO_R48n,_(DQ3R)/(DQ3R)/(DQ1R)) ; port U20
U21: U13.U21(IO,_DIFFIO_R41p) ; port U21
U22: U13.U22(IO,_DIFFIO_R41n,_(DQ1R)/(DQ3R)/(DQ1R)) ; port U22
V1: U13.V1(IO,_DIFFIO_L35n) ; port V1
V2: U13.V2(IO,_DIFFIO_L35p,_(DQ3L)/(DQ3L)/(DQ1L)) ; port V2
V3: U13.V3(IO,_RDN1) ; port V3
V4: U13.V4(IO,_RUP1) ; port V4
V5: U13.V5(IO,_DIFFIO_B1n,_(DM1B)/(_)/(_)) ; port V5
V8: U13.V8(IO,_DIFFIO_B13p) ; port V8
V9: U13.V9(IO,_VREFB3N1) ; port V9
V10: U13.V10(IO,_DIFFIO_B15p,_(DQS3B/CQ3B#,DPCLK2)/(DQS3B/CQ3B#,DPCLK2)/(DQS3B/CQ3B#,DPCLK2)) ; port V10
V11: U13.V11(IO) ; port V11
V12: U13.V12(IO,_VREFB4N2) ; port V12
V13: U13.V13(IO,_DIFFIO_B41p,_(DQS2B/CQ3B,DPCLK5)/(DQS2B/CQ3B,DPCLK5)/(DQS2B/CQ3B,DPCLK5)) ; port V13
V14: U13.V14(IO,_DIFFIO_B43p) ; port V14
V15: U13.V15(IO,_DIFFIO_B44n) ; port V15
V16: U13.V16(IO,_VREFB4N0) ; port V16
V21: U13.V21(IO,_DIFFIO_R43p) ; port V21
V22: U13.V22(IO,_DIFFIO_R43n,_(DQ3R)/(DQ3R)/(DQ1R)) ; port V22
W1: U13.W1(IO,_DIFFIO_L38n) ; port W1
W2: U13.W2(IO,_DIFFIO_L38p,_(DQ3L)/(DQ3L)/(DQ1L)) ; port W2
W6: U13.W6(IO,_DIFFIO_B4p,_(DQ1B)/(_)/(_)) ; port W6
W7: U13.W7(IO,_DIFFIO_B9p,_(DQ3B)/(DQ3B)/(DQ5B)) ; port W7
W8: U13.W8(IO,_DIFFIO_B13n,_(DQ3B)/(DQ3B)/(DQ5B)) ; port W8
W10: U13.W10(IO,_DIFFIO_B23p) ; port W10
W13: U13.W13(IO,_DIFFIO_B36p,_(DQ4B)/(DQ5B)/(DQ5B)) ; port W13
W14: U13.W14(IO,_DIFFIO_B41n) ; port W14
W15: U13.W15(IO,_DIFFIO_B45p,_(DQ2B)/(DQ5B)/(DQ5B)) ; port W15
W17: U13.W17(IO,_DIFFIO_B48p,_(DQ0B)/(_)/(_)) ; port W17
W19: U13.W19(IO,_VREFB5N2) ; port W19
W20: U13.W20(IO,_DIFFIO_R50n,_(DQS3R/CQ3R#,CDPCLK4)/(DQS3R/CQ3R#,CDPCLK4)/(DQS3R/CQ3R#,CDPCLK4)) ; port W20
W21: U13.W21(IO,_DIFFIO_R46p) ; port W21
W22: U13.W22(IO,_DIFFIO_R46n,_(DQ3R)/(DQ3R)/(DQ1R)) ; port W22
Y1: U13.Y1(IO,_DIFFIO_L39n) ; port Y1
Y2: U13.Y2(IO,_DIFFIO_L39p,_(DQ3L)/(DQ3L)/(DQ1L)) ; port Y2
Y3: U13.Y3(IO,_DIFFIO_B3n,_(DQ1B)/(_)/(_)) ; port Y3
Y4: U13.Y4(IO,_DIFFIO_B3p) ; port Y4
Y6: U13.Y6(IO,_(DQS1B/CQ1B#,CDPCLK2)/(DQS1B/CQ1B#,CDPCLK2)/(DQS1B/CQ1B#,CDPCLK2)) ; port Y6
Y7: U13.Y7(IO,_DIFFIO_B9n,_(DQ3B)/(DQ3B)/(DQ5B)) ; port Y7
Y8: U13.Y8(IO,_(DQ5B)/(DQ3B)/(DQ5B)) ; port Y8
Y10: U13.Y10(IO,_DIFFIO_B23n) ; port Y10
Y13: U13.Y13(IO,_DIFFIO_B36n,_(DQS4B/CQ5B,DPCLK4)/(DQS4B/CQ5B,DPCLK4)/(DQS4B/CQ5B,DPCLK4)) ; port Y13
Y14: U13.Y14(IO,_DIFFIO_B39p) ; port Y14
Y15: U13.Y15(IO,_DIFFIO_B39n,_(DQ2B)/(DQ5B)/(DQ5B)) ; port Y15
Y17: U13.Y17(IO,_DIFFIO_B48n,_(DQS0B/CQ1B,CDPCLK3)/(DQS0B/CQ1B,CDPCLK3)/(DQS0B/CQ1B,CDPCLK3)) ; port Y17
Y22: U13.Y22(IO,_DIFFIO_R49n,_(DQ3R)/(DQ3R)/(DQ1R)) ; port Y22
NetC121_2: C121.2 FB2.2 R57.1 Y1.4(VDD)
NetR52_2: R52.2 U14.2(DO)
NetR53_1: R53.1 U14.6(CLK)
NetR57_2: R57.2 Y1.1(EN)
NetR58_2: R58.2 Y1.3(CLK)

Not connected (* = marked no-connect by the designer): JP6 7* 8*; U13 A12(CLK8,_DIFFCLK_5n)* AA11(CLK15,_DIFFCLK_6p)* AA12(CLK13,_DIFFCLK_7p)* AB11(CLK14,_DIFFCLK_6n)* AB12(CLK12,_DIFFCLK_7n)* B11(CLK11,_DIFFCLK_4p)* B12(CLK9,_DIFFCLK_5p)* G1(CLK1,_DIFFCLK_0n)* G21(CLK4,_DIFFCLK_2p)* G22(CLK5,_DIFFCLK_2n)* T1(CLK3,_DIFFCLK_1n)* T2(CLK2,_DIFFCLK_1p)* T21(CLK6,_DIFFCLK_3p)* T22(CLK7,_DIFFCLK_3n)*

## Notes on the sheet
- FPGA BANK1
- FPGA BANK4
- FPGA BANK7
- Power Pin Out
- Reset
- FPGA BANK2
- FPGA BANK5
- FPGA BANK8
- FPGA BANK3
- FPGA BANK6
- (near U13) FPGA Power
- (near U13) FPGA Config
- (near U13) FPGA CLK
- FPGA JTAG
- FPGA FLASH
- XTAL 50MHz
- (in symbol EP4CE115F23C8, part A) BANK 1
- (in symbol EP4CE115F23C8, part B) BANK 2
- (in symbol EP4CE115F23C8, part C) BANK 3
- (in symbol EP4CE115F23C8, part D) BANK 4
- (in symbol EP4CE115F23C8, part E) BANK 5
- (in symbol EP4CE115F23C8, part F) BANK 6
- (in symbol EP4CE115F23C8, part G) BANK 7
- (in symbol EP4CE115F23C8, part H) BANK 8

## Library data of the parts
C57-C115 C117-C125 C147 = Cap
FB2 = FB: 磁珠
JP6 = Header 5PX2: 5*2P接插件; 版权归属: 源创客; BOM名称: 5*2P接插件; 学习资源: www.ooocke.com
R45-R58 = RES
U13 = EP4CE115F23C8: Cyclone IV Family FPGA, 2V Core, 280 I/O Pins, 4 PLLs, 484-Pin FBGA, Speed Grade 8, Commercial Grade; Published: 3-May-2010; DatasheetVersion: ver1.2, Mar-2010; PackageVersion: ver16.0, Dec-2009; PackageReference: FBGA484; Publisher: Altium Limited; PackageDescription: 484-Ball FineLine Ball Grid Array (FBGA484) - Flip Chip; Supplier 1: Digi-Key; Supplier Part Number 1: EP4CE115F23C8-ND; Code_JEDEC: MS-034-AAJ-1; Code_IPC: BGA100P22X22-484; ComponentLink1Description: Manufacturer Link; ComponentLink1URL: http://www.altera.com/; ComponentLink2Description: Handbook; ComponentLink2URL: http://www.altera.com/literature/hb/cyclone-iv/cyclone4-handbook.pdf; ComponentLink3Description: Pinout Specification; ComponentLink3URL: http://www.altera.com/literature/lit-dp.jsp?category=cyc%204&showspreadsheet=y; ComponentLink4Description: Packaging Specification; ComponentLink4URL: http://www.altera.com/literature/ds/dspkg.pdf
U14 = M25Pxx: 外置Flash; 版权归属: 源创客; BOM名称: 外置Flash; 学习资源: www.ooocke.com
Y1 = XTAL-4-Power: 4脚有源晶振